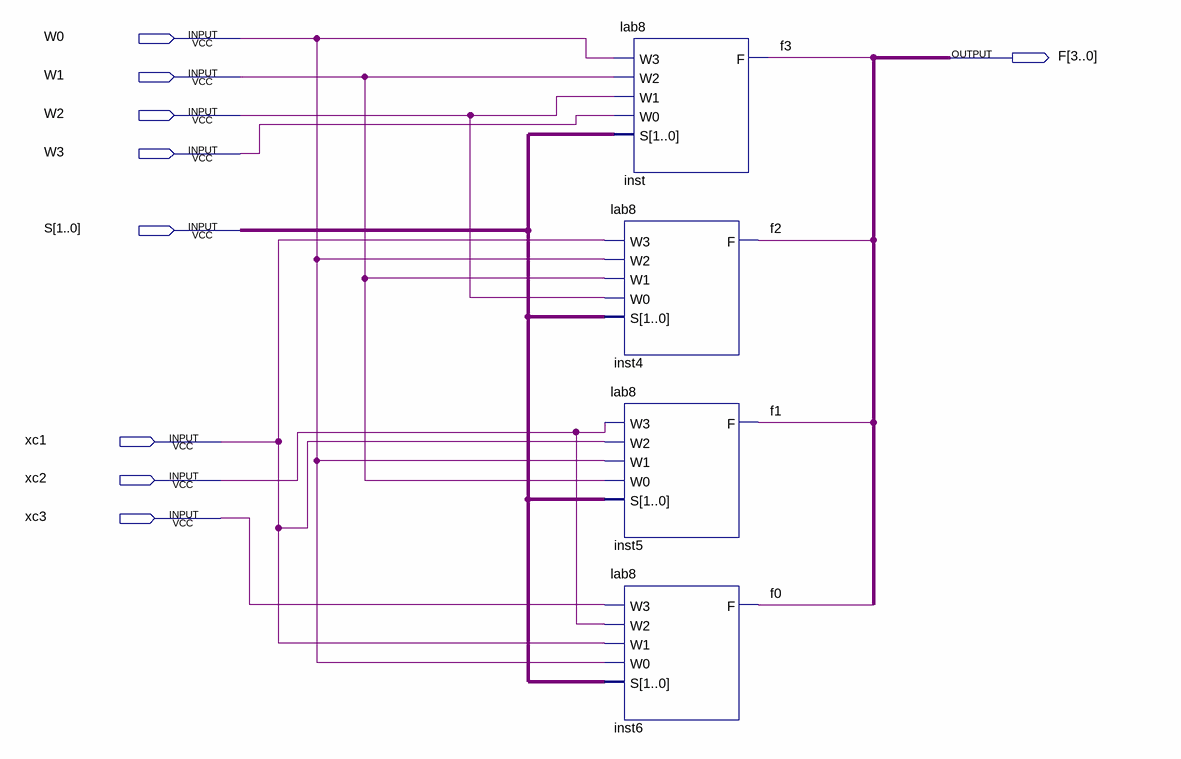
[diagram p0: schematic sheet]
// Quartus schematic finalStep.bdf as structural Verilog: 4 symbols, 9 pins
module finalStep (
  input  W0,
  input  W1,
  input  W2,
  input  W3,
  input  [1:0] S,
  input  xc1,
  input  xc2,
  input  xc3,
  output [3:0] F
);

  lab8 inst (.W3(W0), .W2(W1), .W1(W2), .W0(W3), .S(S), .F(F[3]));
  lab8 inst4 (.W3(xc1), .W2(W0), .W1(W1), .W0(W2), .S(S), .F(F[2]));
  lab8 inst5 (.W3(xc2), .W2(xc1), .W1(W0), .W0(W1), .S(S), .F(F[1]));
  lab8 inst6 (.W3(xc3), .W2(xc2), .W1(xc1), .W0(W0), .S(S), .F(F[0]));
endmodule
